# Altium project RFID-Moritz-Laptop.PrjPcb
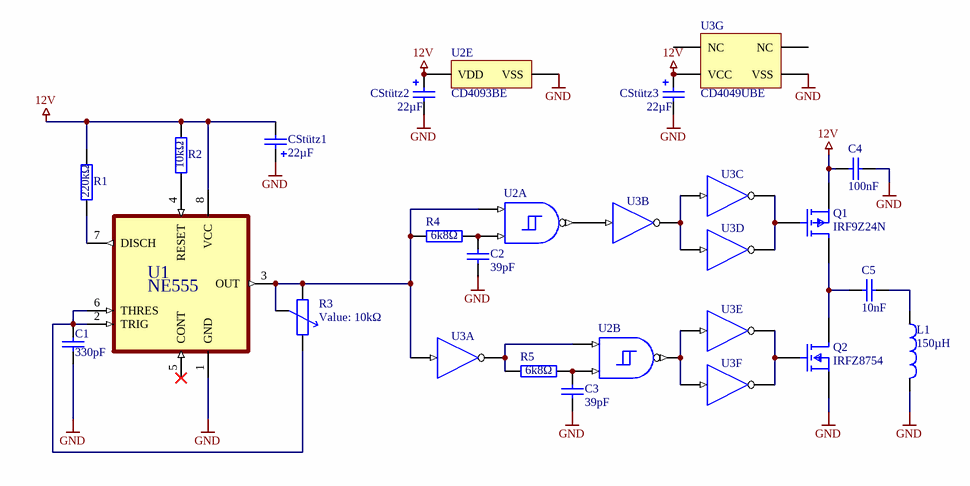
[diagram p0: Lesegerät.SchDoc]
4 sheets, 53 parts. Net scope: flat (ports and power ports of the same name join across sheets).
Sheets:
  Lesegerät.SchDoc
  Lesegerät_RC-Ozillator.SchDoc
  Lesegerät_SigA_MosT_GegE.SchDoc
  Tag.SchDoc

## Sheet Lesegerät.SchDoc
size A4; SheetNumber: 1; SheetTotal: 9; PageSetup: Record=PageOptions|CenterHorizontal=True|CenterVertical=True|PrintScale=0.97|XCorrection=1.00|YCorrection=1.00|PrintKind=2|BorderSize=5000000|LeftOffset=0|BottomOffset=0|Orientation=2|PaperLength=1000|PaperWidth=1000|Scale=100|PaperSource=7|PrintQuality=-3|MediaType=1|DitherType=10|PrintScaleMode=1|PaperKind=A4|PaperIndex=9

### Parts
(Parts that share a designator on the sheet are numbered #1, #2 ... from top to bottom, then left to right.)
C1#1  330pF  [rad-7.2/2.5/5]
C2#1  value 39pF  [rad-7.2/2.5/5]  (hidden comment: KO)
C3#1  value 39pF  [rad-7.2/2.5/5]  (hidden comment: KO)
C4#1  value 100nF  [rad-7.2/2.5/5]  (hidden comment: KO)
C5#1  value 10nF  [rad-7.2/2.5/5]  (hidden comment: KO)
CStütz1#1  value 22µF  [RB-.1/.2]  (hidden comment: ELKO)
CStütz2#1  value 22µF  [RB-.1/.2]  (hidden comment: ELKO)
CStütz3#1  value 22µF  [RB-.1/.2]  (hidden comment: ELKO)
L1#1  value 150µH  (hidden comment: Inductor)
Q1#1  IRF9Z24N  [FP-PG-SOT323-3-IPC_A]
Q2#1  IRFZ8754  [FP-SOT23-IPC_A]
R1#1  value 220kΩ  [Axial-0.4]  (hidden comment: RES)
R2#1  value 10kΩ  [Axial-0.4]  (hidden comment: RES)
R3#1  value 10kΩ  [PT15]  (hidden comment: POT)
R4#1  value 6k8Ω  [Axial-0.4]  (hidden comment: RES)
R5#1  value 6k8Ω  [Axial-0.4]  (hidden comment: RES)
U1#1  NE555  [DIP794W45P254L959H508Q8]
U2#1  CD4093BE  [N0014A]  (value not drawn)  (parts A,B,E of 5)
U3#1  CD4049UBE  [N0016A]  (value not drawn)  (parts A,B,C,D,E,F,G of 7)

### Nets
12V: C4#1.1 CStütz1#1.2 CStütz2#1.1 CStütz3#1.1 Q1#1.2(S) R1#1.2 R2#1.2 U1#1.8(VCC) U2#1.14(VDD) U3#1.1(VCC)
GND: C1#1.2 C2#1.2 C3#1.2 C4#1.2 CStütz1#1.1 CStütz2#1.2 CStütz3#1.2 L1#1.2 Q2#1.2(S) U1#1.1(GND) U2#1.7(VSS) U3#1.8(VSS)
NetC1#1_1: C1#1.1 R3#1.2 U1#1.2(TRIG) U1#1.6(THRES)
NetC2#1_1: C2#1.1 R4#1.2 U2#1.2(B)
NetC3#1_1: C3#1.1 R5#1.2 U2#1.6(D)
NetC5#1_1: C5#1.1 Q1#1.3(D) Q2#1.3(D)
NetC5#1_2: C5#1.2 L1#1.1
NetQ1#1_G2: Q1#1.G2(G) U3#1.6(I=~{C}) U3#1.10(J=~{D})
NetQ2#1_G1: Q2#1.G1(G) U3#1.12(K=~{E}) U3#1.15(L=~{F})
NetR1#1_1: R1#1.1 U1#1.7(DISCH)
NetR2#1_1: R2#1.1 U1#1.4(RESET)
NetR3#1_1: R3#1.1 R3#1.3 R4#1.1 U1#1.3(OUT) U2#1.1(A) U3#1.3(A)
NetR5#1_1: R5#1.1 U2#1.5(C) U3#1.2(G=~{A})
NetU2#1_3: U2#1.3(J) U3#1.5(B)
NetU2#1_4: U2#1.4(K) U3#1.11(E) U3#1.14(F)
NetU3#1_4: U3#1.4(H=~{B}) U3#1.7(C) U3#1.9(D)

Not connected (* = marked no-connect by the designer): U1#1 5(CONT)*; U3#1 13(NC) 16(NC)

### Library data of the parts
C1#1 C2#1 C3#1 C4#1 C5#1 = KO: Kondensator
L1#1 = Inductor: SimulationGenericComponent: True
Q1#1 = CMP-32901-000121-1: MOSFET P-CH 60V 150MA SOT-323; Manufacturer: Infineon; Manufacturer Part Number: BSS84PWH6327XTSA1; Automotive Grade: Grade 0; Turn On Delay Time: 6.7ns; Input Capacitace At Vds: 15.3pF @ -25V; Continuous Drain Current: -0.15A; Transconductance: 0.16S; Depletion Mode: False; Max Forward Diode Voltage: -1.12V; Number Of P Channels: 1; Reverse Recovery Charge: 11.6nC; Reverse Recovery Time: 23.6ns; Drain To Source Breakdown Voltage: -60V; Typ Forward Diode Voltage: -0.84V; Threshold Vgs Max: -2V; Turn Off Delay Time: 8.6ns; Gate Charge At Vgs: 1nC @ -10V; Power Dissipation: 0.3W; Pulse Drain Current: -0.6A; Max Junction Temp: +150°C; Gate To Source Voltage: 20V; Rthja Max: 420K/W; Drain To Source Resistance: 6.9Ω; Threshold Vgs Min: -1V; Footprint Url: https://www.infineon.com/cms/en/product/packages/PG-SOT323/PG-SOT323-3-2/; ComponentLink2URL: https://www.infineon.com/dgdl/Infineon-BSS84PW-DS-v02_00-EN.pdf?fileId=db3a3043321e49940132482056d32474; Temperature Range Low: -55°C; Temperature: -55°C to +150°C; Octopart: https://octopart.com/bss84pwh6327xtsa1-infineon-22361355; Category: Trans; Height: 1mm; Lead Free: Yes; Ipc Land Pattern Name: SOT65P210X90-3; Automotive: Yes; Number Of Channels: 1; Digikey Description: MOSFET P-CH 60V 150MA SOT-323; ComponentLink2Description: Datasheet; Device Class L2: Transistors; Drain To Source Voltage: -60V; Temperature Range High: +150°C; Device Class L1: Discrete Semiconductors; RoHS: TRUE; Mouser Description: MOSFET P-Ch -60V 150mA SOT-323-3; Device Class L3: MOSFETs; Package: PG-SOT323-3
Q2#1 = CMP-12801-000064-2: MOSFET N-CH 60V .15MA SOT23-3; On-State Resistance: 5R; Continuous Drain Current (ID): 150mA; Threshold Voltage: 3V; Number of Channels: 1; Gate to Source Voltage (Vgs): 20V; Turn-On Delay Time: 10ns; Power Dissipation: 330mW; Element Configuration: Single; Input Capacitance: 60pF; Weight: 0.000282oz; Height: 1mm; Max Operating Temperature: 150°C; Dual Supply Voltage: 60V; Termination: SMD/SMT; Number of Pins: 3; Number of Elements: 1; Mount: Surface Mount; Min Operating Temperature: -55°C; Nominal Vgs: 3V; Width: 1.4mm; Drain to Source Breakdown Voltage: 60V; Turn-Off Delay Time: 10ns; Case/Package: SOT-23; REACH SVHC: No SVHC; Packaging: Tape and Reel; Length: 3.05mm; Max Power Dissipation: 330mW; Rds On Max: 5R; Lead Free: Lead Free; Contact Plating: Tin; Drain to Source Resistance: 5R; Drain to Source Voltage (Vdss): 60V; Package Quantity: 3000; Current Rating: 150mA; Voltage Rating (DC): 60V
R1#1 R2#1 R4#1 R5#1 = RES: Widerstand
R3#1 = POT: Potentiometer; Set Position: 0.5
U1#1 = NE555P: Single Precision Timer; MF: Texas; SnapEDA_Link: https://www.snapeda.com/parts/NE555P/Texas+Instruments/view-part/?ref=snap; Package: PDIP-8 Texas; Value: *; MP: NE555P; Check_prices: https://www.snapeda.com/parts/NE555P/Texas+Instruments/view-part/?ref=eda
U2#1 = CMP-1627-00493-3: CMOS Quad 2-Input NAND Schmitt Triggers, N0014A, TUBE; Manufacturer: Texas Instruments; ICC @ Nom Voltage(Max)(mA): 0.06; VCC(Min)(V): 3; Rating: Catalog; Bits(#): 4; Technology Family: CD4000; Output Drive (IOL/IOH)(Max)(mA): 1.5/-1.5; VCC(Max)(V): 18; Voltage(Nom)(V): 10; Schmitt Trigger: Yes; F @ Nom Voltage(Max)(Mhz): 8; DatasheetVersion: SCHS115D; PackageReference: N0014A; Code_JEDEC: MS-001; Output Type: CMOS; Input Type: CMOS; Generic Part Number: CD4093B; Operating Temperature Range(C): -55 to 125
U3#1 = CMP-1615-00914-2: CMOS Hex Inverting Buffer/Converter, N0016A, TUBE; Manufacturer: Texas Instruments; Rating: Military; Voltage(Nom)(V): 5; VCC(Min)(V): 3; VCC(Max)(V): 18; Output Drive (IOL/IOH)(Max)(mA): -1.2/5.2; ICC @ Nom Voltage(Max)(mA): 0.03; F @ Nom Voltage(Max)(Mhz): 12; tpd @ Nom Voltage(Max)(ns): 120; Technology Family: CD4000; Schmitt Trigger: No; Bits(#): 6; Code_JEDEC: MS-001; DatasheetVersion: SCHS046I; Generic Part Number: CD4049UB; Input Type: CMOS; Output Type: CMOS; PackageReference: N0016A; Operating Temperature Range(C): -55 to 125

## Sheet Lesegerät_RC-Ozillator.SchDoc
size A4; SheetNumber: 2; SheetTotal: 4
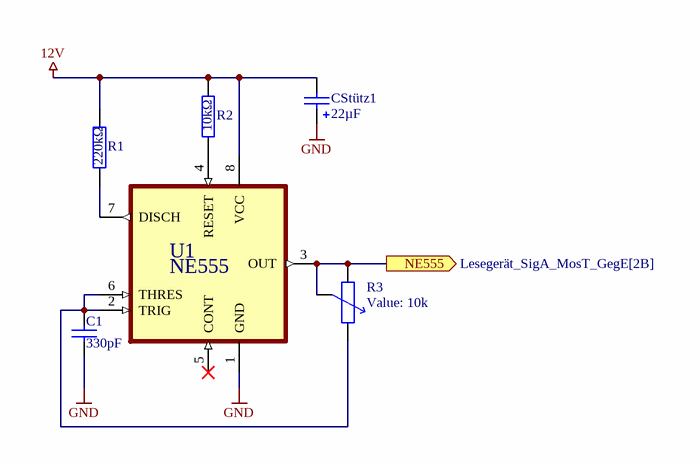
[diagram p1: Lesegerät_RC-Ozillator.SchDoc]

### Parts
(Parts that share a designator on the sheet are numbered #1, #2 ... from top to bottom, then left to right.)
C1#2  330pF  [rad-7.2/2.5/5]
CStütz1#2  value 22µF  [RB-.1/.2]  (hidden comment: ELKO)
R1#2  value 220kΩ  [Axial-0.4]  (hidden comment: RES)
R2#2  value 10kΩ  [Axial-0.4]  (hidden comment: RES)
R3#2  value 10k  [PT15]  (hidden comment: POT)
U1#2  NE555  [DIP794W45P254L959H508Q8]

### Ports
NE555 (out, see Lesegerät_SigA_MosT_GegE[2B])

### Nets
12V: CStütz1#2.2 R1#2.2 R2#2.2 U1#2.8(VCC)
GND: C1#2.2 CStütz1#2.1 U1#2.1(GND)
NetC1#2_1: C1#2.1 R3#2.2 U1#2.2(TRIG) U1#2.6(THRES)
NetR1#2_1: R1#2.1 U1#2.7(DISCH)
NetR2#2_1: R2#2.1 U1#2.4(RESET)
NetR3#2_1: R3#2.1 R3#2.3 U1#2.3(OUT) ; port NE555

Not connected (* = marked no-connect by the designer): U1#2 5(CONT)*

### Library data of the parts
C1#2 = KO: Kondensator
R1#2 R2#2 = RES: Widerstand
R3#2 = POT: Potentiometer; Set Position: 0.5
U1#2 = NE555P: Single Precision Timer; MF: Texas; SnapEDA_Link: https://www.snapeda.com/parts/NE555P/Texas+Instruments/view-part/?ref=snap; Package: PDIP-8 Texas; Value: *; MP: NE555P; Check_prices: https://www.snapeda.com/parts/NE555P/Texas+Instruments/view-part/?ref=eda

## Sheet Lesegerät_SigA_MosT_GegE.SchDoc
size A4; SheetNumber: 3; SheetTotal: 4
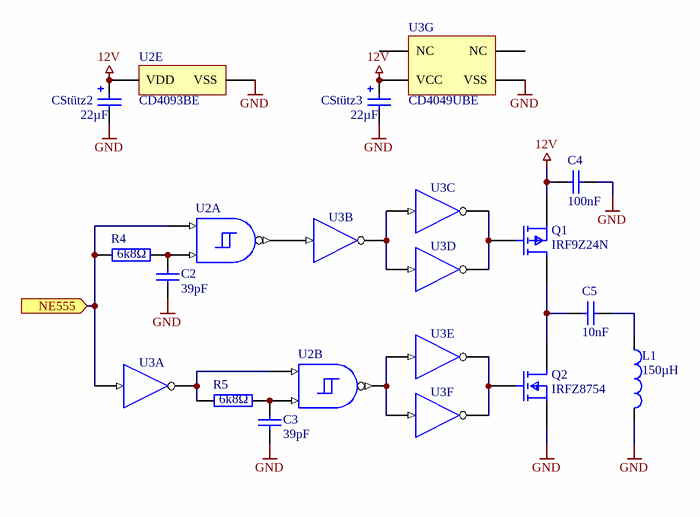
[diagram p2: Lesegerät_SigA_MosT_GegE.SchDoc]

### Parts
(Parts that share a designator on the sheet are numbered #1, #2 ... from top to bottom, then left to right.)
C2#2  value 39pF  [rad-7.2/2.5/5]  (hidden comment: KO)
C3#2  value 39pF  [rad-7.2/2.5/5]  (hidden comment: KO)
C4#2  value 100nF  [rad-7.2/2.5/5]  (hidden comment: KO)
C5#2  value 10nF  [rad-7.2/2.5/5]  (hidden comment: KO)
CStütz2#2  value 22µF  [RB-.1/.2]  (hidden comment: ELKO)
CStütz3#2  value 22µF  [RB-.1/.2]  (hidden comment: ELKO)
L1#2  value 150µH  (hidden comment: Inductor)
Q1#2  IRF9Z24N  [FP-PG-SOT323-3-IPC_A]
Q2#2  IRFZ8754  [FP-SOT23-IPC_A]
R4#2  value 6k8Ω  [Axial-0.4]  (hidden comment: RES)
R5#2  value 6k8Ω  [Axial-0.4]  (hidden comment: RES)
U2#2  CD4093BE  [N0014A]  (value not drawn)  (parts A,B,E of 5)
U3#2  CD4049UBE  [N0016A]  (value not drawn)  (parts A,B,C,D,E,F,G of 7)

### Ports
NE555 (in, see Lesegerät_RC-Ozillator[2B])

### Nets
12V: C4#2.1 CStütz2#2.1 CStütz3#2.1 Q1#2.2(S) U2#2.14(VDD) U3#2.1(VCC)
GND: C2#2.2 C3#2.2 C4#2.2 CStütz2#2.2 CStütz3#2.2 L1#2.2 Q2#2.2(S) U2#2.7(VSS) U3#2.8(VSS)
NetC2#2_1: C2#2.1 R4#2.2 U2#2.2(B)
NetC3#2_1: C3#2.1 R5#2.2 U2#2.6(D)
NetC5#2_1: C5#2.1 Q1#2.3(D) Q2#2.3(D)
NetC5#2_2: C5#2.2 L1#2.1
NetQ1#2_G2: Q1#2.G2(G) U3#2.6(I=~{C}) U3#2.10(J=~{D})
NetQ2#2_G1: Q2#2.G1(G) U3#2.12(K=~{E}) U3#2.15(L=~{F})
NetR3#2_1: R4#2.1 U2#2.1(A) U3#2.3(A) ; port NE555
NetR5#2_1: R5#2.1 U2#2.5(C) U3#2.2(G=~{A})
NetU2#2_3: U2#2.3(J) U3#2.5(B)
NetU2#2_4: U2#2.4(K) U3#2.11(E) U3#2.14(F)
NetU3#2_4: U3#2.4(H=~{B}) U3#2.7(C) U3#2.9(D)

Not connected (* = marked no-connect by the designer): U3#2 13(NC) 16(NC)

### Library data of the parts
C2#2 C3#2 C4#2 C5#2 = KO: Kondensator
L1#2 = Inductor: SimulationGenericComponent: True
Q1#2 = CMP-32901-000121-1: as Q1#1 on sheet Lesegerät; Footprint Url: https://www.infineon.com/cms/en/product/packages/PG-SOT323/PG-SOT323-3-2/; ComponentLink2URL: https://www.infineon.com/dgdl/Infineon-BSS84PW-DS-v02_00-EN.pdf?fileId=db3a3043321e49940132482056d32474; Temperature Range Low: -55°C; Temperature: -55°C to +150°C; Octopart: https://octopart.com/bss84pwh6327xtsa1-infineon-22361355; Category: Trans; Height: 1mm; Lead Free: Yes; Ipc Land Pattern Name: SOT65P210X90-3; Automotive: Yes; Number Of Channels: 1; Digikey Description: MOSFET P-CH 60V 150MA SOT-323; ComponentLink2Description: Datasheet; Device Class L2: Transistors; Drain To Source Voltage: -60V; Temperature Range High: +150°C; Device Class L1: Discrete Semiconductors; RoHS: TRUE; Mouser Description: MOSFET P-Ch -60V 150mA SOT-323-3; Device Class L3: MOSFETs; Package: PG-SOT323-3
Q2#2 = CMP-12801-000064-2: as Q2#1 on sheet Lesegerät; Weight: 0.000282oz; Height: 1mm; Max Operating Temperature: 150°C; Dual Supply Voltage: 60V; Termination: SMD/SMT; Number of Pins: 3; Number of Elements: 1; Mount: Surface Mount; Min Operating Temperature: -55°C; Nominal Vgs: 3V; Width: 1.4mm; Drain to Source Breakdown Voltage: 60V; Turn-Off Delay Time: 10ns; Case/Package: SOT-23; REACH SVHC: No SVHC; Packaging: Tape and Reel; Length: 3.05mm; Max Power Dissipation: 330mW; Rds On Max: 5R; Lead Free: Lead Free; Contact Plating: Tin; Drain to Source Resistance: 5R; Drain to Source Voltage (Vdss): 60V; Package Quantity: 3000; Current Rating: 150mA; Voltage Rating (DC): 60V
R4#2 R5#2 = RES: Widerstand
U2#2 = CMP-1627-00493-3: as U2#1 on sheet Lesegerät; DatasheetVersion: SCHS115D; PackageReference: N0014A; Code_JEDEC: MS-001; Output Type: CMOS; Input Type: CMOS; Generic Part Number: CD4093B; Operating Temperature Range(C): -55 to 125
U3#2 = CMP-1615-00914-2: as U3#1 on sheet Lesegerät; Code_JEDEC: MS-001; DatasheetVersion: SCHS046I; Generic Part Number: CD4049UB; Input Type: CMOS; Output Type: CMOS; PackageReference: N0016A; Operating Temperature Range(C): -55 to 125

## Sheet Tag.SchDoc
size A4; SheetNumber: 4; SheetTotal: 4
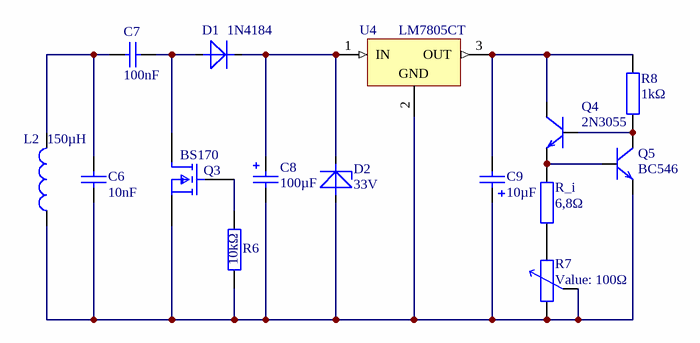
[diagram p3: Tag.SchDoc]

### Parts
C6  value 10nF  [rad-7.2/2.5/5]  (hidden comment: KO)
C7  value 100nF  [rad-7.2/2.5/5]  (hidden comment: KO)
C8  value 100µF  [RB-.1/.2]  (hidden comment: ELKO)
C9  value 10µF  [RB-.1/.2]  (hidden comment: ELKO)
D1  1N4184  [DIODE-0.6]
D2  33V  [DIODE-0.4]
L2  value 150µH  (hidden comment: Inductor)
Q3  BS170  [FP-SOT23-IPC_A]
Q4  2N3055  [TO-92/EBC]
Q5  BC546  [TO-92/EBC]
R6  value 10kΩ  [Axial-0.4]  (hidden comment: RES)
R7  value 100Ω  [PT15]  (hidden comment: POT)
R8  value 1kΩ  [Axial-0.4]  (hidden comment: RES)
R_i  value 6,8Ω  [Axial-0.4]  (hidden comment: RES)
U4  LM7805CT  [FAIR-TO-220-3]

### Nets
NetC6_1: C6.1 C8.2 C9.1 D2.1(A) L2.2 Q3.2(S) Q5.2(E) R6.1 R7.1 R7.3 U4.2(GND)
NetC6_2: C6.2 C7.2 L2.1
NetC7_1: C7.1 D1.1(A) Q3.3(D)
NetC8_1: C8.1 D1.2(K) D2.2(K) U4.1(IN)
NetC9_2: C9.2 Q4.3(C) R8.2 U4.3(OUT)
NetQ3_G1: Q3.G1(G) R6.2
NetQ4_1: Q4.1(B) Q5.3(C) R8.1
NetQ4_2: Q4.2(E) Q5.1(B) R_i.2
NetR7_2: R7.2 R_i.1

### Library data of the parts
C6 C7 = KO: Kondensator
D1 = DIODE
D2 = Z-DIODE
L2 = Inductor: SimulationGenericComponent: True
Q3 = CMP-12801-000064-2: as Q2#1 on sheet Lesegerät; Weight: 0.000282oz; Height: 1mm; Max Operating Temperature: 150°C; Dual Supply Voltage: 60V; Termination: SMD/SMT; Number of Pins: 3; Number of Elements: 1; Mount: Surface Mount; Min Operating Temperature: -55°C; Nominal Vgs: 3V; Width: 1.4mm; Drain to Source Breakdown Voltage: 60V; Turn-Off Delay Time: 10ns; Case/Package: SOT-23; REACH SVHC: No SVHC; Packaging: Tape and Reel; Length: 3.05mm; Max Power Dissipation: 330mW; Rds On Max: 5R; Lead Free: Lead Free; Contact Plating: Tin; Drain to Source Resistance: 5R; Drain to Source Voltage (Vdss): 60V; Package Quantity: 3000; Current Rating: 150mA; Voltage Rating (DC): 60V
Q4 Q5 = NPN: Transistor
R6 R8 R_i = RES: Widerstand
R7 = POT: Potentiometer; Set Position: 0.5
U4 = CMP-2000-04938-1: Positive Voltage Regulator, 5 V, 1 A, -40 to 125 degC, 3-Pin TO-220, RoHS, Tube; Manufacturer: FairchildSemiconductor; Maximum Input Voltage: 35V; Maximum Quiescent Current: 8mA; Load Regulation: 100mV; Maximum Output Current: 2.2(Typ)A; Output Type: Fixed; Typical Dropout Voltage @ Current: 2@1AV; Rad Hard: No; Output Voltage: 5V; Accuracy: ±4%; Number of Outputs: 1; Category: LinearRegulator; Package Description: 3-Pin Through Hole Device, Body 10 x 4.5 mm, Pitch 2.54 mm; Packaging: Rail/Tube; Mounting: ThroughHole; Polarity: Positive; Manufacturer URL: https://www.fairchildsemi.com/; Line Regulation: 100mV; Datasheet Version: Aug-12; Datasheet URL: https://datasheet.ciiva.com/26904/lm7805ct-26904988.pdf; Package Reference: TO-220; Package URL: https://www.fairchildsemi.com/package-drawings/TO/TO220B03.pdf; Package: 3TO-220AB; Operating Temperature: -40to125degC; Type: Linear

## Nets that join several sheets
12V: Lesegerät (10 pins), Lesegerät_RC-Ozillator (CStütz1#2.2 R1#2.2 R2#2.2 U1#2.8), Lesegerät_SigA_MosT_GegE (6 pins)
GND: Lesegerät (12 pins), Lesegerät_RC-Ozillator (C1#2.2 CStütz1#2.1 U1#2.1), Lesegerät_SigA_MosT_GegE (9 pins)
NetR3#2_1: Lesegerät_RC-Ozillator (R3#2.1 R3#2.3 U1#2.3), Lesegerät_SigA_MosT_GegE (R4#2.1 U2#2.1 U3#2.3)